# Altium project driverBoard.PrjPcb
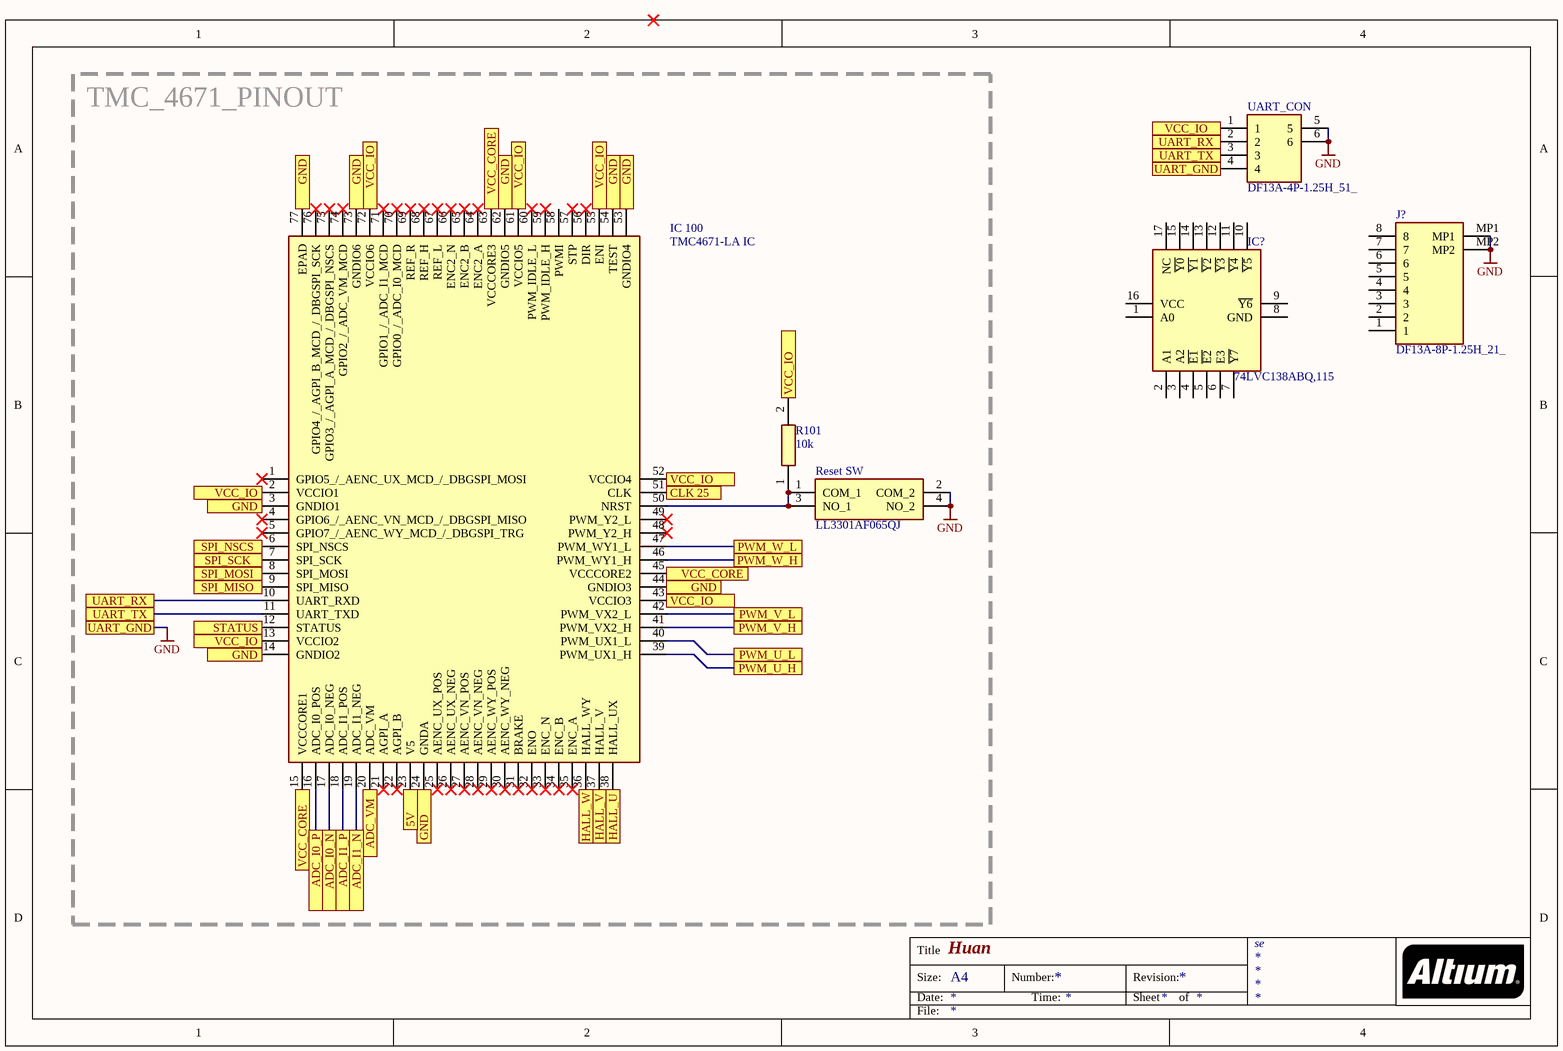
[diagram p0: driverBoard.SchDoc]
1 sheet, 6 parts. Net scope: flat (ports and power ports of the same name join across sheets).
Board file: driverBoard.PcbDoc

## Sheet driverBoard.SchDoc: Huan
size A4; Date: dssd; Organization: se

### Parts
IC?  74LVC138ABQ,115  [74HCT595BQ115]
IC_100  TMC4671-LA IC  [QFN40P1050X650X90-77N]
J?  DF13A-8P-1.25H_21_  [DF13A8P125H21]
R101  10k  [RESC1608X55N]
Reset_SW  LL3301AF065QJ  [LL3301FF065QJ]
UART_CON  DF13A-4P-1.25H_51_  [DF13A4P125H51]

### Blocks framed on the sheet
TMC_4671_PINOUT: IC_100 R101 Reset_SW

### Ports
5V, ADC_I0_N, ADC_I0_P, ADC_I1_N, ADC_I1_P, ADC_VM, CLK 25, GND, HALL_U, HALL_V, HALL_W, PWM_U_H, PWM_U_L, PWM_V_H, PWM_V_L, PWM_W_H, PWM_W_L, SPI_MISO, SPI_MOSI, SPI_NSCS, SPI_SCK, STATUS, UART_GND, UART_RX, UART_TX, VCC_CORE, VCC_IO

### Nets
GND: J?.MP1 J?.MP2 Reset_SW.2(COM_2) Reset_SW.4(NO_2) UART_CON.4 UART_CON.5 UART_CON.6 ; port UART_GND
NetIC_100_2: IC_100.2(VCCIO1) IC_100.13(VCCIO2) IC_100.43(VCCIO3) IC_100.52(VCCIO4) IC_100.55(ENI) IC_100.61(VCCIO5) IC_100.72(VCCIO6) R101.2 UART_CON.1 ; port VCC_IO
NetIC_100_3: IC_100.3(GNDIO1) IC_100.14(GNDIO2) IC_100.24(GNDA) IC_100.44(GNDIO3) IC_100.53(GNDIO4) IC_100.54(TEST) IC_100.62(GNDIO5) IC_100.73(GNDIO6) IC_100.77(EPAD) ; port GND
NetIC_100_6: IC_100.6(SPI_NSCS) ; port SPI_NSCS
NetIC_100_7: IC_100.7(SPI_SCK) ; port SPI_SCK
NetIC_100_8: IC_100.8(SPI_MOSI) ; port SPI_MOSI
NetIC_100_9: IC_100.9(SPI_MISO) ; port SPI_MISO
NetIC_100_10: IC_100.10(UART_RXD) UART_CON.2 ; port UART_RX
NetIC_100_11: IC_100.11(UART_TXD) UART_CON.3 ; port UART_TX
NetIC_100_12: IC_100.12(STATUS) ; port STATUS
NetIC_100_15: IC_100.15(VCCCORE1) IC_100.45(VCCCORE2) IC_100.63(VCCCORE3) ; port VCC_CORE
NetIC_100_16: IC_100.16(ADC_I0_POS) ; port ADC_I0_P
NetIC_100_17: IC_100.17(ADC_I0_NEG) ; port ADC_I0_N
NetIC_100_18: IC_100.18(ADC_I1_POS) ; port ADC_I1_P
NetIC_100_19: IC_100.19(ADC_I1_NEG) ; port ADC_I1_N
NetIC_100_20: IC_100.20(ADC_VM) ; port ADC_VM
NetIC_100_23: IC_100.23(V5) ; port 5V
NetIC_100_36: IC_100.36(HALL_WY) ; port HALL_W
NetIC_100_37: IC_100.37(HALL_V) ; port HALL_V
NetIC_100_38: IC_100.38(HALL_UX) ; port HALL_U
NetIC_100_39: IC_100.39(PWM_UX1_H) ; port PWM_U_H
NetIC_100_40: IC_100.40(PWM_UX1_L) ; port PWM_U_L
NetIC_100_41: IC_100.41(PWM_VX2_H) ; port PWM_V_H
NetIC_100_42: IC_100.42(PWM_VX2_L) ; port PWM_V_L
NetIC_100_46: IC_100.46(PWM_WY1_H) ; port PWM_W_H
NetIC_100_47: IC_100.47(PWM_WY1_L) ; port PWM_W_L
NetIC_100_50: IC_100.50(NRST) R101.1 Reset_SW.1(COM_1) Reset_SW.3(NO_1)
NetIC_100_51: IC_100.51(CLK) ; port CLK 25

Not connected (* = marked no-connect by the designer): IC? 1(A0) 2(A1) 3(A2) 4(~{E1}) 5(~{E2}) 6(E3) 7(~{Y7}) 8(GND) 9(~{Y6}) 10(~{Y5}) 11(~{Y4}) 12(~{Y3}) 13(~{Y2}) 14(~{Y1}) 15(~{Y0}) 16(VCC) 17(NC); IC_100 1(GPIO5_/_AENC_UX_MCD_/_DBGSPI_MOSI)* 4(GPIO6_/_AENC_VN_MCD_/_DBGSPI_MISO)* 5(GPIO7_/_AENC_WY_MCD_/_DBGSPI_TRG)* 21(AGPI_A)* 22(AGPI_B)* 25(AENC_UX_POS)* 26(AENC_UX_NEG)* 27(AENC_VN_POS)* 28(AENC_VN_NEG)* 29(AENC_WY_POS)* 30(AENC_WY_NEG)* 31(BRAKE)* 32(ENO)* 33(ENC_N)* 34(ENC_B)* 35(ENC_A)* 48(PWM_Y2_H)* 49(PWM_Y2_L)* 56(DIR)* 57(STP)* 58(PWMI) 59(PWM_IDLE_H)* 60(PWM_IDLE_L)* 64(ENC2_A)* 65(ENC2_B)* 66(ENC2_N)* 67(REF_L)* 68(REF_H)* 69(REF_R)* 70(GPIO0_/_ADC_I0_MCD)* 71(GPIO1_/_ADC_I1_MCD)* 74(GPIO2_/_ADC_VM_MCD)* 75(GPIO3_/_AGPI_A_MCD_/_DBGSPI_NSCS)* 76(GPIO4_/_AGPI_B_MCD_/_DBGSPI_SCK)*; J? 1 2 3 4 5 6 7 8

### Notes on the sheet
- Title
- Size:
- Date:
- A4
- Number:
- Time:
- Revision:
- Sheet
- of
- File:

### Library data of the parts
IC? = 74LVC138ABQ,115: Integrated Circuit; Manufacturer_Name: Nexperia; Datasheet Link: https://assets.nexperia.com/documents/data-sheet/74LVC138A.pdf; Manufacturer_Part_Number: 74LVC138ABQ,115; Arrow Part Number: 74LVC138ABQ,115; Arrow Price/Stock: https://www.arrow.com/en/products/74lvc138abq115/nexperia; Mouser Part Number: 771-LVC138ABQ115; Mouser Price/Stock: https://www.mouser.co.uk/ProductDetail/Nexperia/74LVC138ABQ115?qs=me8TqzrmIYUqHGpwzmLq4w%3D%3D
J? = DF13A-8P-1.25H_21_: Connector; Manufacturer_Name: Hirose; Manufacturer_Part_Number: DF13A-8P-1.25H(21); Datasheet Link: http://uk.rs-online.com/web/p/products/7793617P; Height: 3.6mm; Mouser Part Number: 798-DF13A8P125H21; Mouser Price/Stock: https://www.mouser.co.uk/ProductDetail/Hirose-Connector/DF13A-8P-125H21?qs=XQjbzJWzFPViW0MGk5%2FVbA%3D%3D
R101 = RC0603FR-0710KL: Resistor; Manufacturer_Name: YAGEO (PHYCOMP); Datasheet Link: http://www.yageo.com/documents/recent/PYu-RC0603_51_RoHS_L_v5.pdf; Height: 0.55mm; Manufacturer_Part_Number: RC0603FR-0710KL; Arrow Part Number: RC0603FR-0710KL; Arrow Price/Stock: https://www.arrow.com/en/products/rc0603fr-0710kl/yageo; Mouser Part Number: 603-RC0603FR-0710KL; Mouser Price/Stock: https://www.mouser.co.uk/ProductDetail/Yageo/RC0603FR-0710KL?qs=grNVn54RoB%252B3GtjbJj3wJQ%3D%3D
Reset_SW = LL3301AF065QJ: Switch; Manufacturer_Name: E-Switch; Datasheet Link: https://media.digikey.com/pdf/Data%20Sheets/E-Switch%20PDFs/LL3301AF065QJ.pdf; Height: 7.3mm; Manufacturer_Part_Number: LL3301AF065QJ; Mouser Part Number: 612-LL3301AF065QJ; Mouser Price/Stock: https://www.mouser.co.uk/ProductDetail/E-Switch/LL3301AF065QJ?qs=QtyuwXswaQi68RkbBY57jQ%3D%3D
UART_CON = DF13A-4P-1.25H_51_: Connector; Manufacturer_Name: Hirose; Manufacturer_Part_Number: DF13A-4P-1.25H(51); Datasheet Link: https://www.hirose.com/product/en/products/DF13/DF13A-4P-1.25H%2851%29/; Height: 3mm; Mouser Part Number: 798-DF13A4P125H51; Mouser Price/Stock: https://www.mouser.co.uk/ProductDetail/Hirose-Connector/DF13A-4P-125H51?qs=XQjbzJWzFPVR%252B%2FH2vthd9w%3D%3D